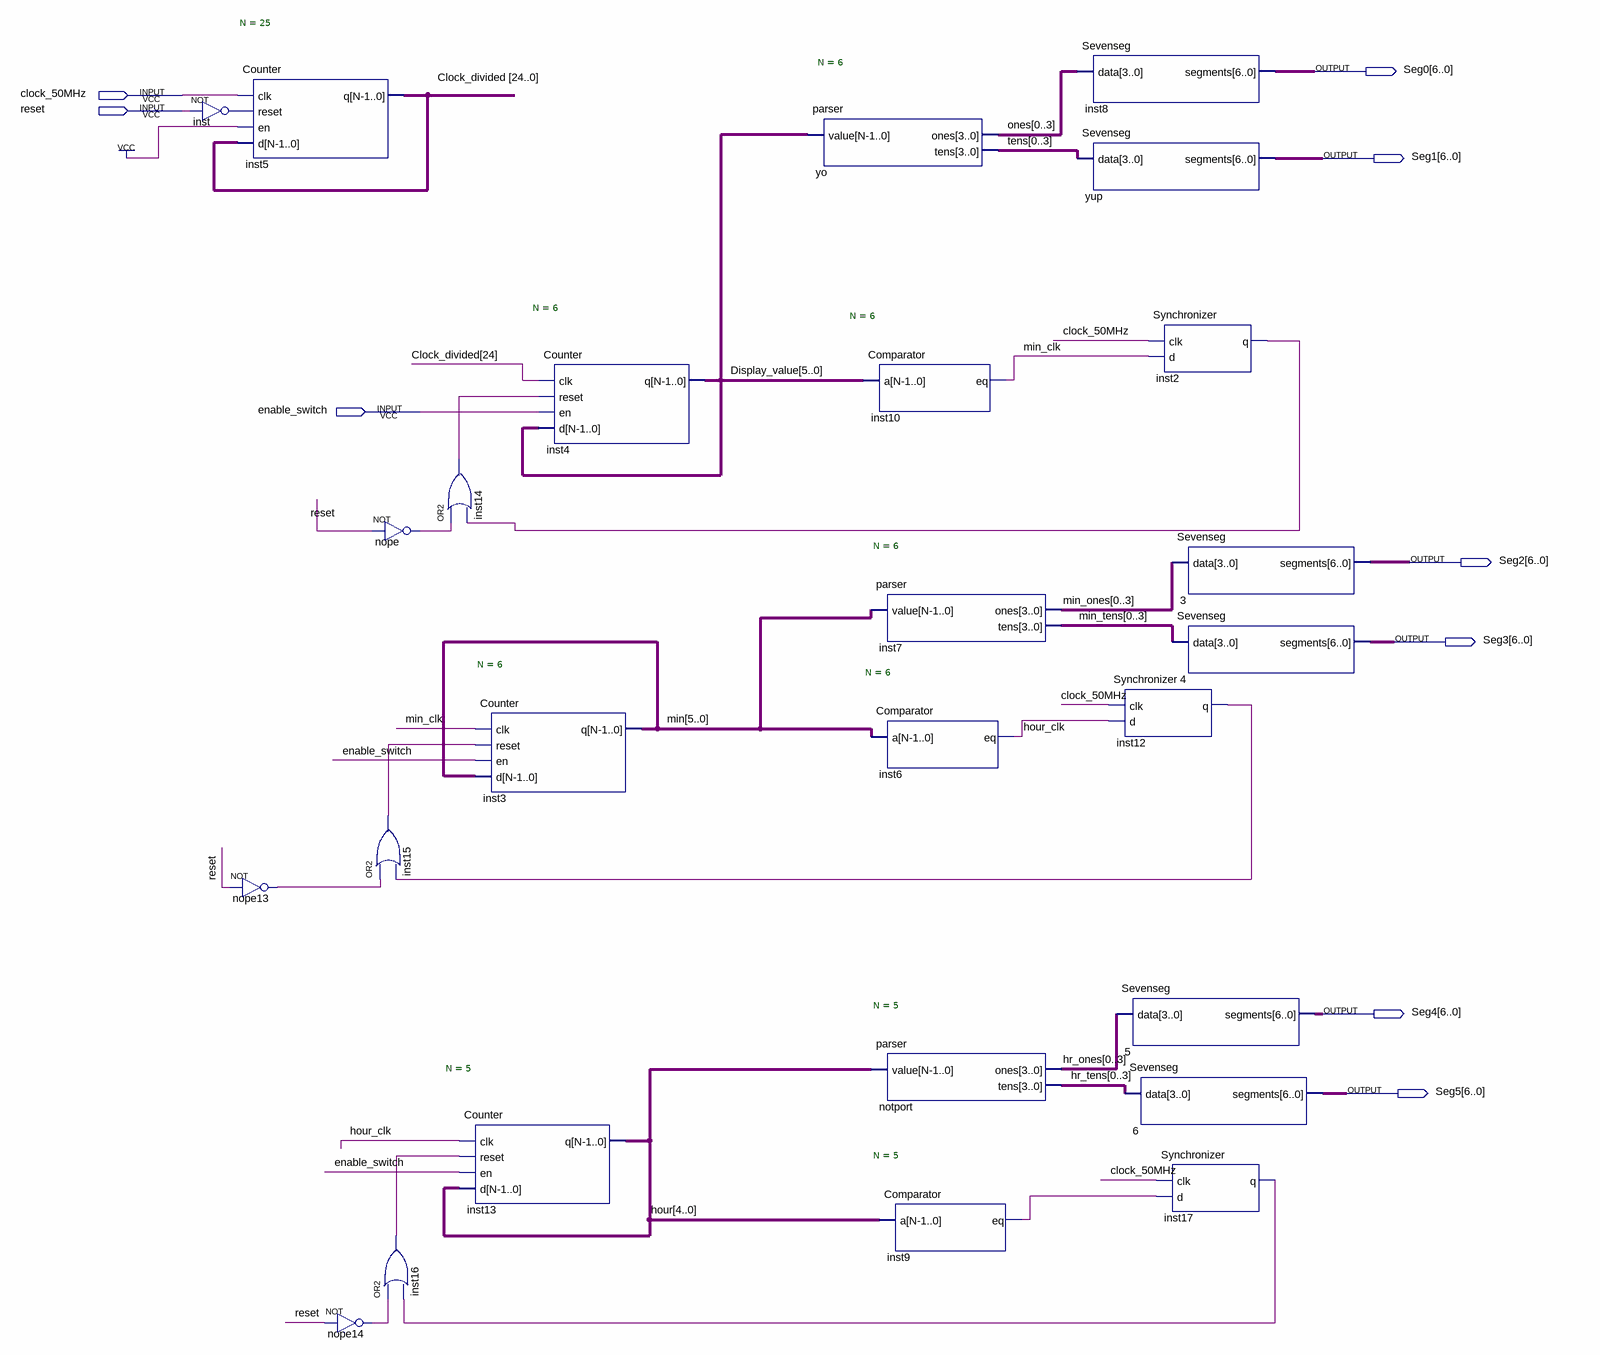
[diagram p0: schematic sheet]
// Quartus schematic Clocktop.bdf as structural Verilog: 26 symbols, 9 pins
module Clocktop (
  input  clock_50MHz,
  input  reset,
  input  enable_switch,
  output [6:0] Seg0,
  output [6:0] Seg1,
  output [6:0] Seg2,
  output [6:0] Seg3,
  output [6:0] Seg4,
  output [6:0] Seg5
);

  wire hour_clk, inst2_q, inst9_eq, inst12_q, inst14_out, inst15_out, inst16_out, inst17_q, inst_out,
       min_clk, nope13_out, nope14_out, nope_out;
  wire [3:0] hr_ones, hr_tens, min_ones, min_tens, ones, tens;
  wire [4:0] hour;
  wire [5:0] Display_value, min;
  wire [24:0] Clock_divided;

  Counter #(.N(25)) inst5 (.clk(clock_50MHz), .reset(inst_out), .en(1'b1), .d(Clock_divided), .q(Clock_divided));
  not inst (inst_out, reset);
  not nope13 (nope13_out, reset);
  or inst15 (inst15_out, nope13_out, inst12_q);
  not nope14 (nope14_out, reset);
  not nope (nope_out, reset);
  or inst16 (inst16_out, nope14_out, inst17_q);
  or inst14 (inst14_out, nope_out, inst2_q);
  Counter #(.N(6)) inst3 (.clk(min_clk), .reset(inst15_out), .en(enable_switch), .d(min), .q(min));
  Counter #(.N(5)) inst13 (.clk(hour_clk), .reset(inst16_out), .en(enable_switch), .d(hour), .q(hour));
  Counter #(.N(6)) inst4 (
    .clk(Clock_divided[24]), .reset(inst14_out), .en(enable_switch), .d(Display_value), .q(Display_value));
  parser #(.N(6)) yo (
    .value(Display_value), .ones({ones[0], ones[1], ones[2], ones[3]}),
    .tens({tens[0], tens[1], tens[2], tens[3]}));
  Comparator #(.N(6)) inst10 (.a(Display_value), .eq(min_clk));
  parser #(.N(6)) inst7 (
    .value(min), .ones({min_ones[0], min_ones[1], min_ones[2], min_ones[3]}),
    .tens({min_tens[0], min_tens[1], min_tens[2], min_tens[3]}));
  Comparator #(.N(6)) inst6 (.a(min), .eq(hour_clk));
  parser #(.N(5)) notport (
    .value(hour), .ones({hr_ones[0], hr_ones[1], hr_ones[2], hr_ones[3]}),
    .tens({hr_tens[0], hr_tens[1], hr_tens[2], hr_tens[3]}));
  Comparator #(.N(5)) inst9 (.a(hour), .eq(inst9_eq));
  Sevenseg inst8 (.data({ones[0], ones[1], ones[2], ones[3]}), .segments(Seg0));
  Sevenseg yup (.data({tens[0], tens[1], tens[2], tens[3]}), .segments(Seg1));
  Synchronizer inst12 (.clk(clock_50MHz), .d(hour_clk), .q(inst12_q));
  Sevenseg u_5 (.data({hr_ones[0], hr_ones[1], hr_ones[2], hr_ones[3]}), .segments(Seg4));
  Sevenseg u_6 (.data({hr_tens[0], hr_tens[1], hr_tens[2], hr_tens[3]}), .segments(Seg5));
  Synchronizer inst2 (.clk(clock_50MHz), .d(min_clk), .q(inst2_q));
  Sevenseg u_3 (.data({min_ones[0], min_ones[1], min_ones[2], min_ones[3]}), .segments(Seg2));
  Sevenseg u_4 (.data({min_tens[0], min_tens[1], min_tens[2], min_tens[3]}), .segments(Seg3));
  Synchronizer inst17 (.clk(clock_50MHz), .d(inst9_eq), .q(inst17_q));
endmodule
